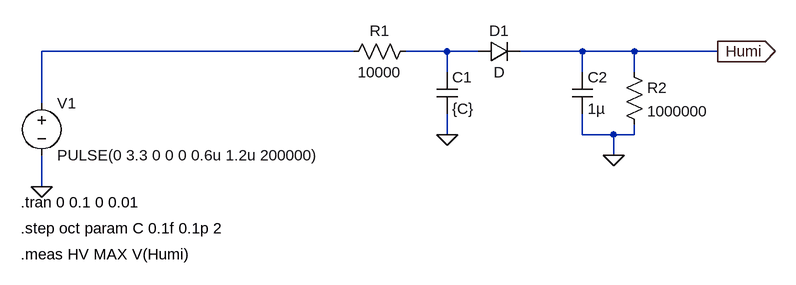
[diagram p0: schematic soil_sensor_analysis.asc]
soil_sensor_analysis.asc, the LTspice schematic file:
Version 4
SHEET 1 1160 680
WIRE 480 32 0 32
WIRE 624 32 560 32
WIRE 672 32 624 32
WIRE 832 32 736 32
WIRE 912 32 832 32
WIRE 1040 32 912 32
WIRE 624 64 624 32
WIRE 832 64 832 32
WIRE 912 64 912 32
WIRE 0 112 0 32
WIRE 624 160 624 128
WIRE 832 160 832 128
WIRE 880 160 832 160
WIRE 912 160 912 144
WIRE 912 160 880 160
WIRE 880 192 880 160
WIRE 0 240 0 192
FLAG 0 240 0
FLAG 624 160 0
FLAG 880 192 0
FLAG 1040 32 Humi
IOPIN 1040 32 Out
SYMBOL voltage 0 96 R0
WINDOW 123 0 0 Left 0
WINDOW 39 0 0 Left 0
SYMATTR InstName V1
SYMATTR Value PULSE(0 3.3 0 0 0 0.6u 1.2u 200000)
SYMBOL res 576 16 R90
WINDOW 0 0 56 VBottom 2
WINDOW 3 32 56 VTop 2
SYMATTR InstName R1
SYMATTR Value 10000
SYMBOL cap 608 64 R0
SYMATTR InstName C1
SYMATTR Value {C}
SYMBOL diode 672 48 R270
WINDOW 0 32 32 VTop 2
WINDOW 3 0 32 VBottom 2
SYMATTR InstName D1
SYMBOL cap 816 64 R0
SYMATTR InstName C2
SYMATTR Value 1µ
SYMBOL res 896 48 R0
SYMATTR InstName R2
SYMATTR Value 1000000
TEXT -32 264 Left 2 !.tran 0 0.1 0 0.01
TEXT -32 304 Left 2 !.step oct param C 0.1f 0.1p 2
TEXT -32 344 Left 2 !.meas HV MAX V(Humi)

The netlist it stands for:
* soil_sensor_analysis.asc
V1 N001 0 PULSE(0 3.3 0 0 0 0.6u 1.2u 200000)
R1 N002 N001 10000
C1 N002 0 {C}
D1 N002 Humi D
C2 Humi 0 1µ
R2 Humi 0 1000000
.model D D
.lib standard.dio
.tran 0 0.1 0 0.01
.step oct param C 0.1f 0.1p 2
.meas HV MAX V(Humi)
.backanno
.end

* Results of the author's LTspice run, read from the files saved beside the schematic
* From the log:
*   Measurement: hv
*     step  MAX(v(humi))  FROM  TO
*        1  2.69318  0  0.1
*        2  2.69318  0  0.1
*        3  2.69329  0  0.1
*        4  2.69325  0  0.1
*        5  2.69332  0  0.1
*        6  2.69335  0  0.1
*        7  2.69333  0  0.1
*        8  2.69246  0  0.1
*        9  2.69308  0  0.1
*       10  2.69245  0  0.1
*       11  2.69286  0  0.1
*       12  2.69168  0  0.1
*       13  2.69307  0  0.1
*       14  2.69283  0  0.1
*       15  2.69297  0  0.1
*       16  2.69265  0  0.1
*       17  2.69204  0  0.1
*       18  2.69281  0  0.1
*       19  2.69254  0  0.1
*       20  2.6924  0  0.1
*       21  2.69213  0  0.1